# Altium schematic sheet watchdog.SchDoc
size A4; Organization: Badgerloop; Address1: 133 Engineering Research; Address2: Building; Address3: Madison, WI 53715
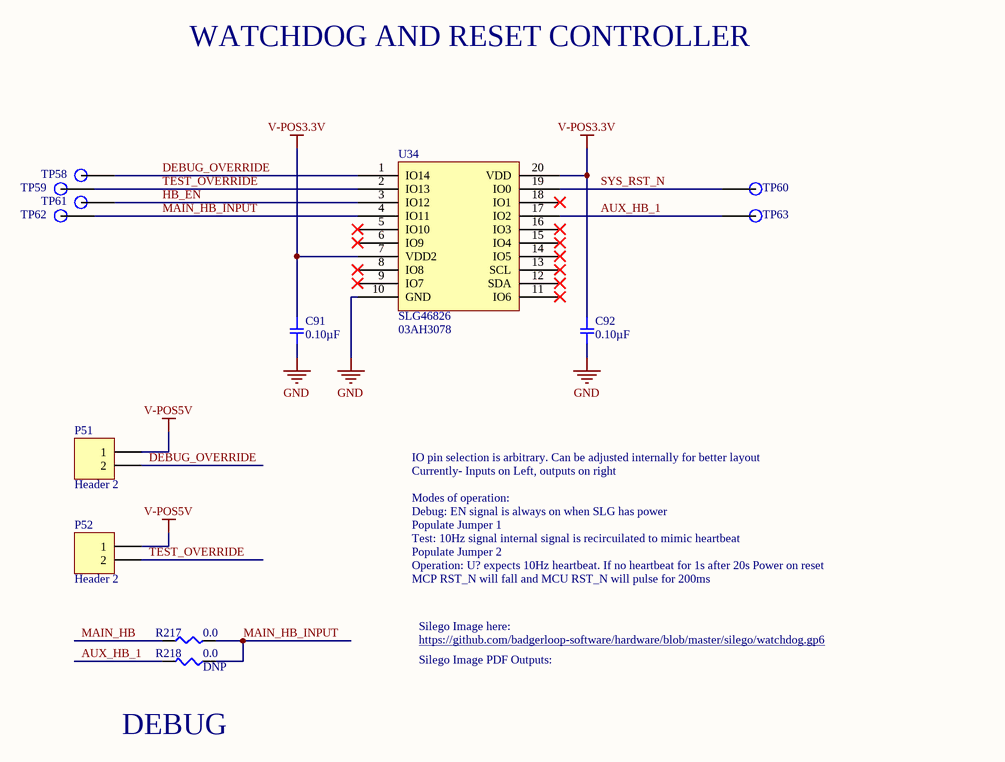
[diagram p0: watchdog.SchDoc]

## Parts
C91  0.10µF  [SMD-0805C]
C92  0.10µF  [SMD-0805C]
P51  Header 2  [Pin Header 1x2 TH Pitch 2.54mm]
P52  Header 2  [Pin Header 1x2 TH Pitch 2.54mm]
R217  0.0  [SMD-0805-RES]
R218  0.0  [SMD-0805-RES]
TP58  TP  [Test Point]  (value not drawn)
TP59  TP  [Test Point]  (value not drawn)
TP60  TP  [Test Point]  (value not drawn)
TP61  TP  [Test Point]  (value not drawn)
TP62  TP  [Test Point]  (value not drawn)
TP63  TP  [Test Point]  (value not drawn)
U34  SLG46826  Supplier Part Number 1: 03AH3078  [SOP65P640X175-20N]

## Nets
GND: C91.2 C92.2 U34.10(GND)
V-POS3.3V: C91.1 C92.1 U34.7(VDD2) U34.20(VDD)
V-POS5V: P51.1 P52.1
AUX_HB_1: R218.2 TP63.1 U34.17(IO2)
DEBUG_OVERRIDE: P51.2 TP58.1 U34.1(IO14)
HB_EN: TP61.1 U34.3(IO12)
MAIN_HB: R217.1
MAIN_HB_INPUT: R217.2 R218.1 TP62.1 U34.4(IO11)
SYS_RST_N: TP60.1 U34.19(IO0)
TEST_OVERRIDE: P52.2 TP59.1 U34.2(IO13)

Not connected (* = marked no-connect by the designer): U34 5(IO10)* 6(IO9)* 8(IO8)* 9(IO7)* 11(IO6)* 12(SDA)* 13(SCL)* 14(IO5)* 15(IO4)* 16(IO3)* 18(IO1)*

## Notes on the sheet
- WATCHDOG AND RESET CONTROLLER
- IO pin selection is arbitrary. Can be adjusted internally for better layout
- Currently- Inputs on Left, outputs on right
- Modes of operation:
- Debug: EN signal is always on when SLG has power
- Populate Jumper 1
- Test: 10Hz signal internal signal is recircuilated to mimic heartbeat
- Populate Jumper 2
- Operation: U? expects 10Hz heartbeat. If no heartbeat for 1s after 20s Power on reset
- MCP RST_N will fall and MCU RST_N will pulse for 200ms
- https://github.com/badgerloop-software/hardware/blob/master/silego/watchdog.gp6
- Silego Image here:
- Silego Image PDF Outputs:
- DEBUG
- Title
- Size:
- Date:
- A4
- Number:
- Time:
- Revision:
- Sheet
- of
- File:

## Library data of the parts
C91 C92 = GRM219R71E104KA01D: CAP CER 0.1UF 25V X7R 0805; Manufacturer: Murata Electronics North America; Factory Stock: 0; Unit Price (USD): 0.12; Minimum Quantity: 1; Tolerance: ±10%; Datasheets: http://www.murata.com/~/media/webrenewal/support/library/catalog/products/capacitor/mlcc/c02e.pdf; Image: //media.digikey.com/Renders/Murata%20Renders/0805%20(2012%20Metric)%20.85mm.jpg; Digi-Key Part Number: 490-12754-1-ND; Part Number: GRM219R71E104KA01D; Quantity Available: 8594; @ qty: 0; Packaging: Cut Tape (CT); Series: GRM; Part Status: Active; Value: 0.10µF; Voltage: 25V; Temperature Coefficient: X7R; Operating Temperature: -55°C ~ 125°C; Features: -; Ratings: -; Applications: General Purpose; Mounting Type: Surface Mount, MLCC; Package / Case: 0805 (2012 Metric); Size / Dimension: 0.079" L x 0.049" W (2.00mm x 1.25mm); Height - Seated (Max): -; Thickness (Max): 0.037" (0.95mm); Lead Spacing: -; Lead Style: -
P51 P52 = Header 2: Header, 2-Pin; LatestRevisionDate: 17-Jul-2002; LatestRevisionNote: Re-released for DXP Platform.; Publisher: Altium Limited
R217 R218 = ERJ-6GEY0R00V: RES SMD 0.0 OHM JUMPER 1/8W 0805; Manufacturer: Panasonic Electronic Components; Factory Stock: 0; Unit Price (USD): 0.00544; @ qty: 1500; Minimum Quantity: 1; Power (Watts): 0.125W, 1/8W; Part Number: ERJ-6GEY0R00V; Datasheets: http://industrial.panasonic.com/www-cgi/jvcr13pz.cgi?E+PZ+3+AOA0001+ERJ6GEY0R00V+7+WW; Image: //media.digikey.com/Renders/Panasonic%20Renders/ERJ-0805%20Pkg.jpg; Digi-Key Part Number: P0.0ACT-ND; Quantity Available: 1597627; Packaging: Cut Tape (CT); Series: ERJ; Part Status: Active; Value: 0.0; Tolerance: Jumper; Composition: Thick Film; Features: Automotive AEC-Q200; Temperature Coefficient: -; Operating Temperature: -55°C ~ 155°C; Package / Case: 0805 (2012 Metric); Supplier Device Package: 0805; Size / Dimension: 0.079" L x 0.049" W (2.00mm x 1.25mm); Height - Seated (Max): 0.028" (0.70mm); Number of Terminations: 2; Failure Rate: -
  R218: DNP: DNP
TP58-TP63 = TP: SMD TEST POINT
U34 = SLG46826: GreenPAK Programmable Mixed Signal Matrix with In-System Programmability; Manufacturer: Dialog Semiconductor; Manufacturer Part Number: SLG46826V-SKT; Supplier 1: Newark; Stock 1: 4; Pricing 1: 1=45.65000, 5=44.43000, 10=43.15000, 25=42.51000, 50=41.89000, 100=39.38000 (USD); RoHS: No